# EAGLE design sensor only (EAGLE 7.6.0)
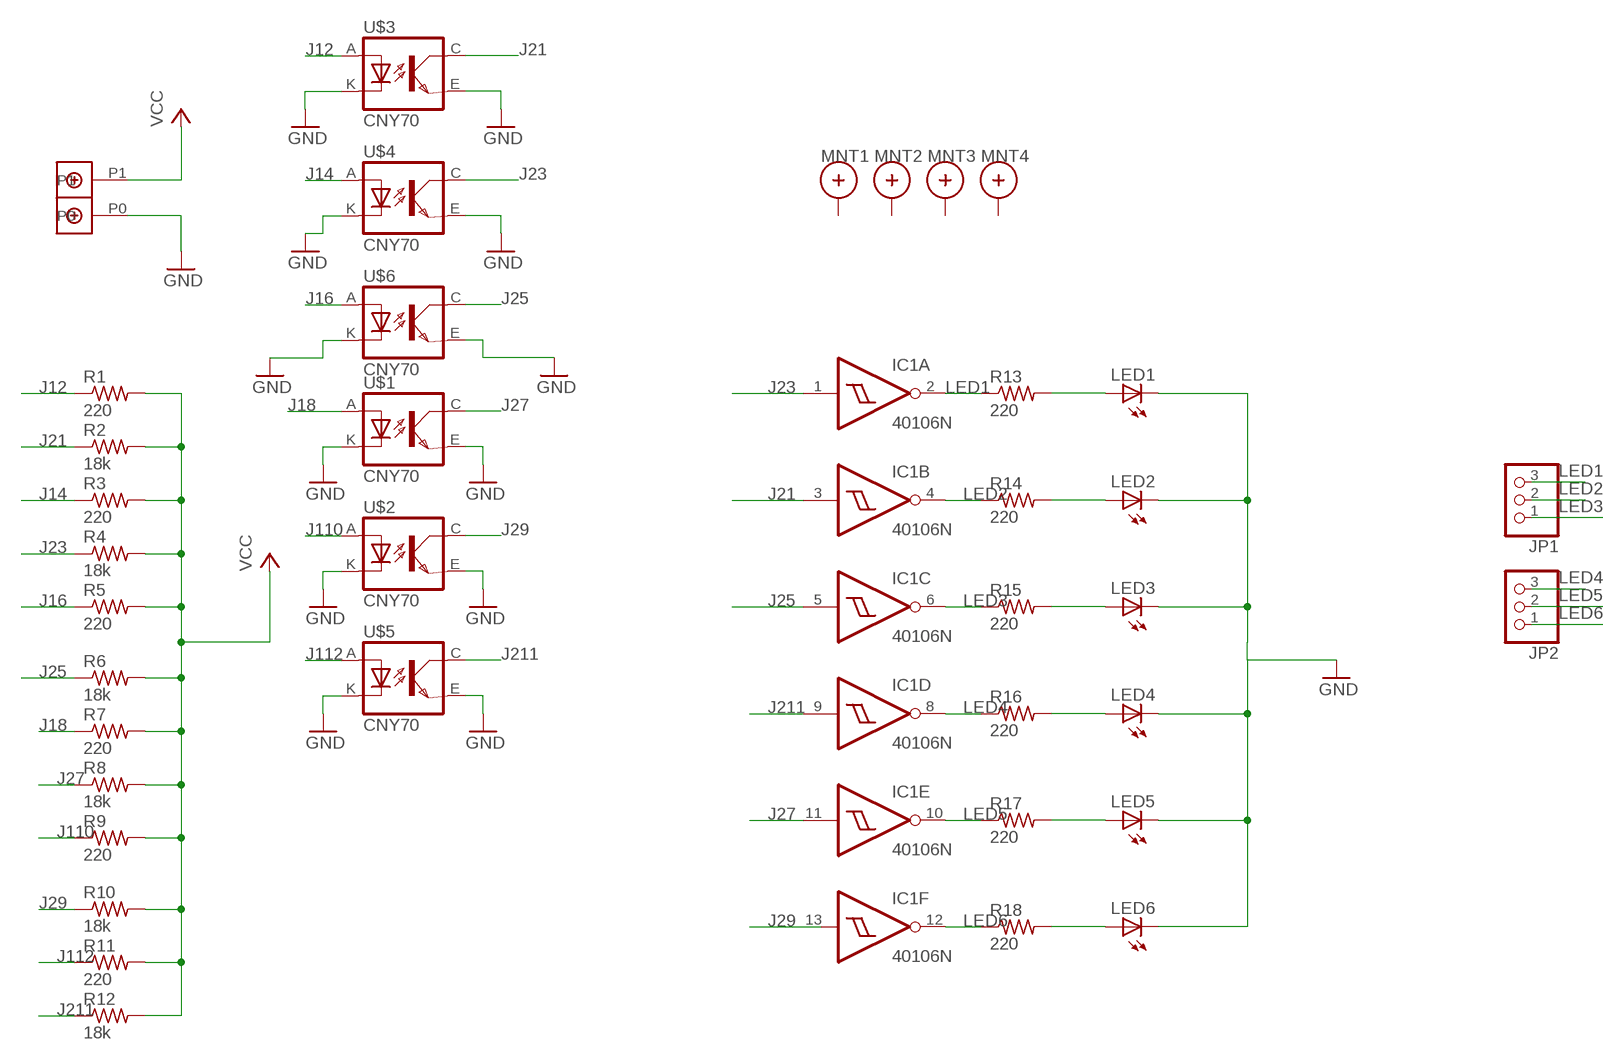
[diagram p0: schematic, sheet 1]

## Parts
IC1  40106N  [DIL14]
JP1  PINHD-1X3  [1X03]
JP2  PINHD-1X3  [1X03]
LED1  LEDCHIPLED_1206  [CHIPLED_1206]
LED2  LEDCHIPLED_1206  [CHIPLED_1206]
LED3  LEDCHIPLED_1206  [CHIPLED_1206]
LED4  LEDCHIPLED_1206  [CHIPLED_1206]
LED5  LEDCHIPLED_1206  [CHIPLED_1206]
LED6  LEDCHIPLED_1206  [CHIPLED_1206]
MNT1  HOLE_MNT_0.135  [HOLE_MNT_#5-40]
MNT2  HOLE_MNT_0.135  [HOLE_MNT_#5-40]
MNT3  HOLE_MNT_0.135  [HOLE_MNT_#5-40]
MNT4  HOLE_MNT_0.135  [HOLE_MNT_#5-40]
R1  220  R-US_M1206  [M1206]
R2  18k  R-US_M1206  [M1206]
R3  220  R-US_M1206  [M1206]
R4  18k  R-US_M1206  [M1206]
R5  220  R-US_M1206  [M1206]
R6  18k  R-US_M1206  [M1206]
R7  220  R-US_M1206  [M1206]
R8  18k  R-US_M1206  [M1206]
R9  220  R-US_M1206  [M1206]
R10  18k  R-US_M1206  [M1206]
R11  220  R-US_M1206  [M1206]
R12  18k  R-US_M1206  [M1206]
R13  220  R-US_M1206  [M1206]
R14  220  R-US_M1206  [M1206]
R15  220  R-US_M1206  [M1206]
R16  220  R-US_M1206  [M1206]
R17  220  R-US_M1206  [M1206]
R18  220  R-US_M1206  [M1206]
U$1  CNY70  [4]
U$2  CNY70  [4]
U$3  CNY70  [4]
U$4  CNY70  [4]
U$5  CNY70  [4]
U$6  CNY70  [4]
U$7  DBCONN-1X2  [DBCONN-1X2]

## Nets
GND: LED1.C LED2.C LED3.C LED4.C LED5.C LED6.C U$1.E(EMI) U$1.K(C) U$2.E(EMI) U$2.K(C) U$3.E(EMI) U$3.K(C) U$4.E(EMI) U$4.K(C) U$5.E(EMI) U$5.K(C) U$6.E(EMI) U$6.K(C) U$7.P0
J12: R1.1 U$3.A
J14: R3.1 U$4.A
J16: R5.1 U$6.A
J18: R7.1 U$1.A
J21: IC1.3(B:I) R2.1 U$3.C(COL)
J23: IC1.1(A:I) R4.1 U$4.C(COL)
J25: IC1.5(C:I) R6.1 U$6.C(COL)
J27: IC1.11(E:I) R8.1 U$1.C(COL)
J29: R10.1 U$2.C(COL)
J110: R9.1 U$2.A
J112: R11.1 U$5.A
J211: IC1.9(D:I) R12.1 U$5.C(COL)
LED1: IC1.2(A:O) JP1.3 R13.1
LED2: IC1.4(B:O) JP1.2 R14.1
LED3: IC1.6(C:O) JP1.1 R15.1
LED4: IC1.8(D:O) JP2.3 R16.1
LED5: IC1.10(E:O) JP2.2 R17.1
LED6: IC1.12(F:O) JP2.1 R18.1
N$10: LED1.A R13.2
N$11: LED2.A R14.2
N$12: LED3.A R15.2
N$13: LED4.A R16.2
N$14: LED5.A R17.2
N$15: LED6.A R18.2
VCC: R1.2 R2.2 R3.2 R4.2 R5.2 R6.2 R7.2 R8.2 R9.2 R10.2 R11.2 R12.2 U$7.P1
Unconnected: IC1.13(F:I) MNT1.P$1 MNT2.P$1 MNT3.P$1 MNT4.P$1

## Power pins joined to a net without a drawn wire
VDD: IC1.14(P:VDD)
VSS: IC1.7(P:VSS)

## Library data of the parts
IC1 = 40xx:40106: Hex SCHMITT TRIGGER
JP1 JP2 = pinhead:PINHD-1X3: PIN HEADER
LED1-LED6 = led:LED: LED OSRAM: - CHIPLED LG R971, LG N971, LY N971, LG Q971, LY Q971, LO R971, LY R971 LH N974, LH R974 LS Q976, LO Q976, LY Q976 LO Q996 - Hyper CHIPLED LW Q18S LB Q993, LB Q99A, LB R99A - SideLED LS A670, LO A670, LY A670, LG A670, LP A670 LB A673, LV A673, LT A673, LW A673 LH A674 LY A675 LS A676, LA A676, LO A676, LY A676, LW A676 LS A679, LY A679, LG A679 - Hyper Micro SIDELED® LS Y876, LA Y876, LO Y876, LY Y876 LT Y87S - SmartLED LW L88C, LW L88S LB L89C, LB L89S, LG L890 LS L89K, LO L89K, LY L89K LS L896, LA L896, LO L896, LY L896 - TOPLED LS T670, LO T670, LY T670, LG T670, LP T670 LSG T670, LSP T670, LSY T670, LOP T670, LYG T670 LG T671, LOG T671, LSG T671 LB T673, LV T673, LT T673, LW T673 LH T674 LS T676, LA T676, LO T676, LY T676, LB T676, LH T676, LSB T676, LW T676 LB T67C, LV T67C, LT T67C, LS T67K, LO T67K, LY T67K, LW E67C LS E67B, LA E67B, LO E67B, LY E67B, LB E67C, LV E67C, LT E67C LW T67C LS T679, LY T679, LG T679 LS T770, LO T770, LY T770, LG T770, LP T770 LB T773, LV T773, LT T773, LW T773 LH T774 LS E675, LA E675, LY E675, LS T675 LS T776, LA T776, LO T776, LY T776, LB T776 LHGB T686 LT T68C, LB T68C - Hyper Mini TOPLED® LB M676 - Mini TOPLED Santana® LG M470 LS M47K, LO M47K, LY M47K Source: http://www.osram.convergy.de LUXEON: - LUMILED® LXK2-PW12-R00, LXK2-PW12-S00, LXK2-PW14-U00, LXK2-PW14-V00 LXK2-PM12-R00, LXK2-PM12-S00, LXK2-PM14-U00 LXK2-PE12-Q00, LXK2-PE12-R00, LXK2-PE12-S00, LXK2-PE14-T00, LXK2-PE14-U00 LXK2-PB12-K00, LXK2-PB12-L00, LXK2-PB12-M00, LXK2-PB14-N00, LXK2-PB14-P00, LXK2-PB14-Q00 LXK2-PR12-L00, LXK2-PR12-M00, LXK2-PR14-Q00, LXK2-PR14-R00 LXK2-PD12-Q00, LXK2-PD12-R00, LXK2-PD12-S00 LXK2-PH12-R00, LXK2-PH12-S00 LXK2-PL12-P00, LXK2-PL12-Q00, LXK2-PL12-R00 Source: www.luxeon.com KINGBRIGHT: KA-3528ASYC Source: www.kingbright.com
MNT1-MNT4 = Existing Library:HOLE_MNT_0.135: Mounting Hole. 0.135 plated hole created for a #5-40 screw, McMaster p/n 91772A125
R1-R18 = resistor:R-US_: RESISTOR, American symbol
U$1-U$6 = cny70:CNY70
U$7 = Terminal Block Connector:DBCONN-1X2

## Board
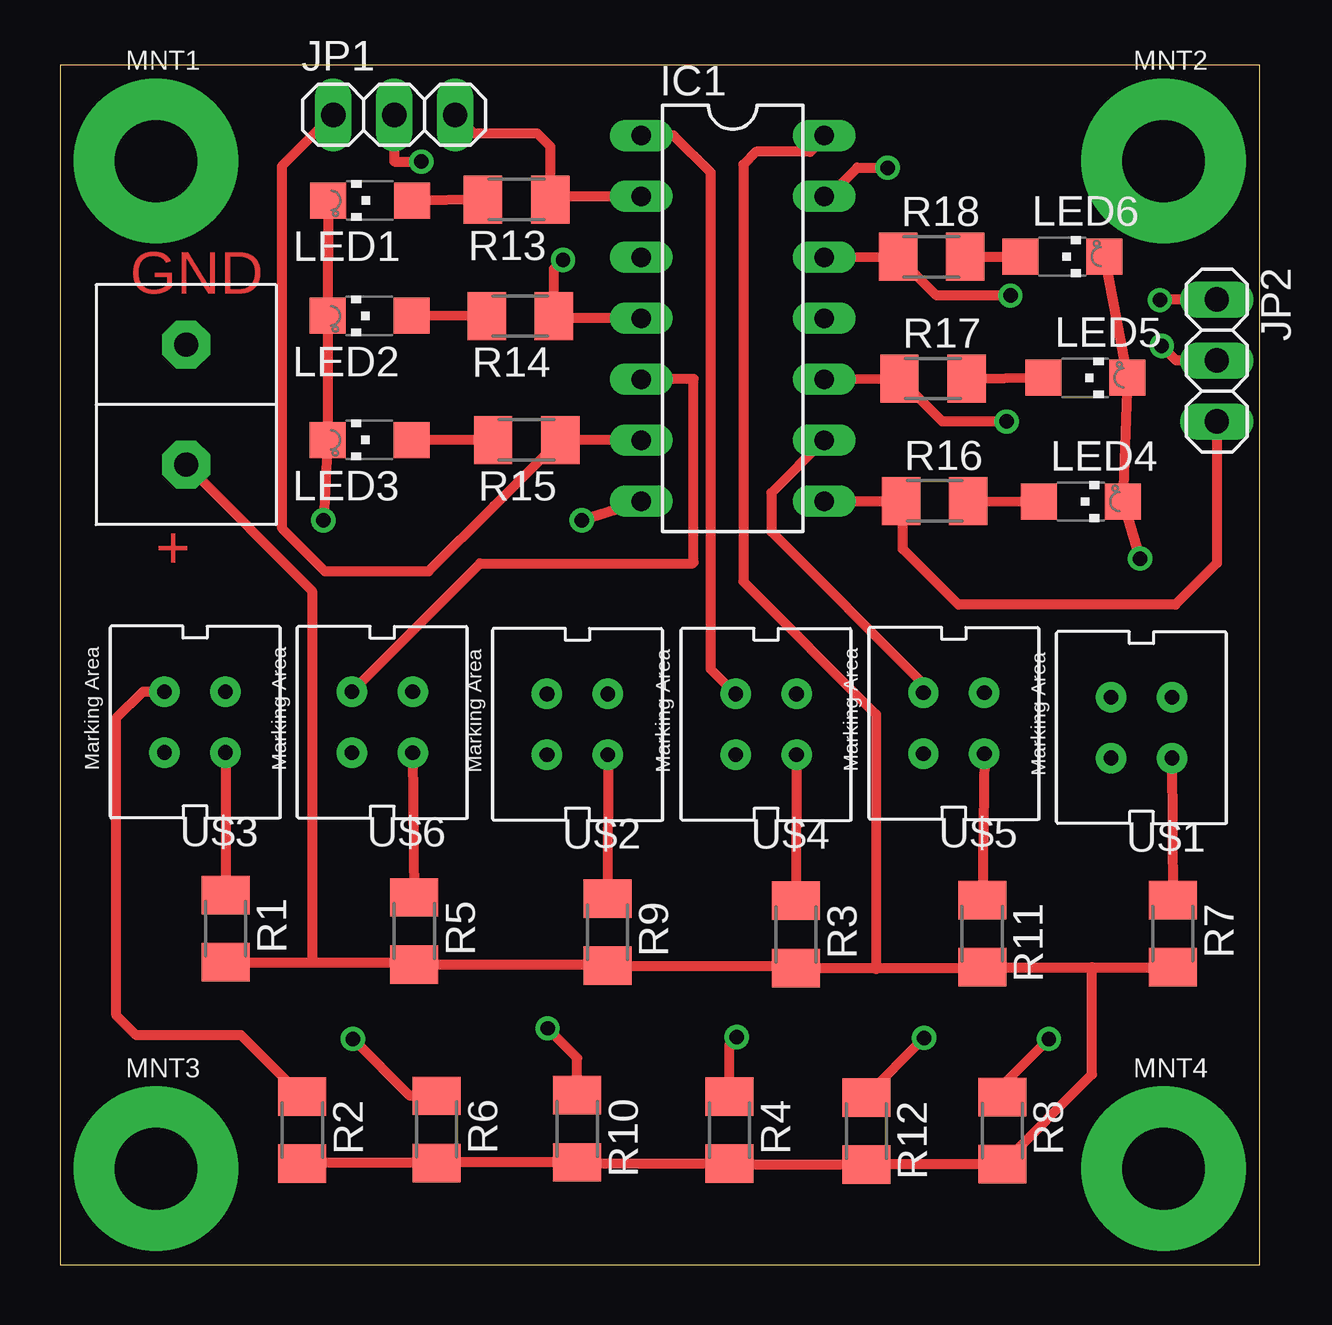
[diagram p1: board, top side]
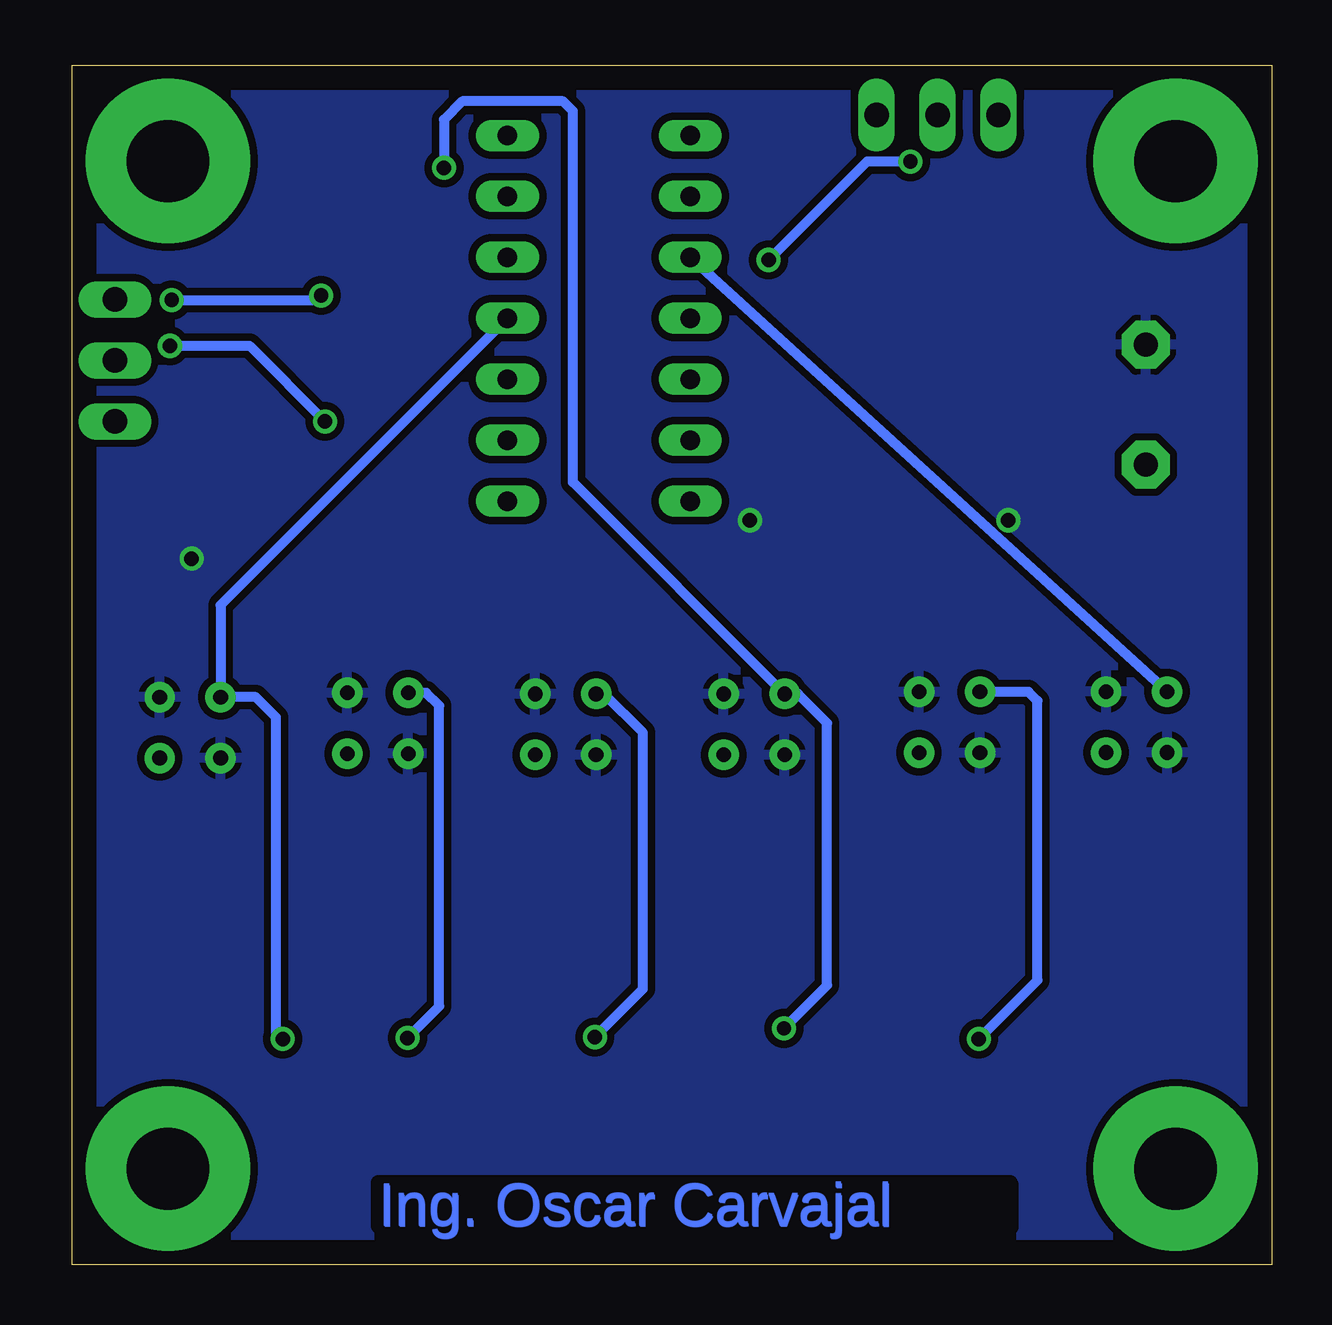
[diagram p2: board, bottom side, seen from below]

Size 50 x 50 mm. Coordinates in mm from the lower left corner, seen from the top.
Outline: 0,0 50,0 50,50 0,50 0,0
Copper layers (1*16): Top 0.035mm / dielectric 1.5mm / Bottom 0.035mm
Design rules "default": minimum track width 10mil, minimum drill 24mil, track to track 8mil, track to pad 8mil, pad to pad 8mil, via to via 8mil, smd to smd 8mil, copper to edge 40mil, drill to drill 8mil, minimum pad ring 10mil, minimum via ring 8mil, stop-mask expansion 4mil, vias tented up to drill 0mil, thermal gap 10mil

### Footprints (pad centres in the part's own frame; a part is rotated, then mirrored left to right if it is on the bottom)
DIL14 = drill 0.813 long: 1 -7.62,-3.81; 2 -5.08,-3.81; 3 -2.54,-3.81; 4 0,-3.81; 5 2.54,-3.81; 6 5.08,-3.81; 7 7.62,-3.81; 8 7.62,3.81; 9 5.08,3.81; 10 2.54,3.81; 11 0,3.81; 12 -2.54,3.81; 13 -5.08,3.81; 14 -7.62,3.81
1X03 = drill 1.016 long: 1 -2.54,0; 2 0,0; 3 2.54,0
CHIPLED_1206 = smd 1.5 x 1.5: A 0,-1.75; C 0,1.75
HOLE_MNT_#5-40 = drill 3.429 pad 6.858: P$1 0,0
M1206 = smd 1.6 x 2: 1 -1.4,0; 2 1.4,0
4 = drill 0.61 pad 1.27: A -1.27,1.27; C 1.27,-1.27; E 1.27,1.27; K -1.27,-1.27
DBCONN-1X2 = drill 1 pad 2 octagon: P0 -2.54,0; P1 2.46,0

### Placement (x,y rotation side)
IC1  28.04,39.45 270 top
JP1  13.93,47.93 0 top
JP2  48.22,37.69 270 top
LED1  12.92,44.36 90 top
LED2  12.9,39.55 90 top
LED3  12.9,34.38 90 top
LED4  42.55,31.81 270 top
LED5  42.73,36.97 270 top
LED6  41.78,42.02 270 top
MNT1  4,46 0 top
MNT2  46,46 0 top
MNT3  4,4 0 top
MNT4  46,4 0 top
R1  6.91,14.01 270 top
R2  10.1,5.61 270 top
R3  30.68,13.77 270 top
R4  27.91,5.61 270 top
R5  14.77,13.91 270 top
R6  15.7,5.64 270 top
R7  46.39,13.8 270 top
R8  39.28,5.59 270 top
R9  22.82,13.86 270 top
R10  21.56,5.67 270 top
R11  38.44,13.8 270 top
R12  33.61,5.57 270 top
R13  19.03,44.4 180 top
R14  19.19,39.54 180 top
R15  19.45,34.38 180 top
R16  36.46,31.84 0 top
R17  36.39,36.94 0 top
R18  36.33,42.01 0 top
U$1  45.08,22.39 180 top
U$2  21.57,22.52 180 top
U$3  5.63,22.62 180 top
U$4  29.43,22.52 180 top
U$5  37.26,22.57 180 top
U$6  13.43,22.61 180 top
U$7  5.25,35.81 270 top

### Tracks (layer width: path | path; a pad name or v marks a point on that pad's centre or on a via)
GND  (via drill 0.6)
  Top 0.406: LED6.C LED5.C LED4.C v45.02,29.43 | LED1.C LED2.C LED3.C v10.98,31.03
  other vias: 21.75,31.03
  pour Bottom (isolate 0.305): 7.82,49.37 49.59,49.37 49.59,0.35 0.35,0.35 0.35,10.8 0.35,49.65 7.82,49.65
J12
  Top 0.406: U$3.A R1.1
J14
  Top 0.406: U$4.A R3.1
J16
  Top 0.406: U$6.A R5.1
J18
  Top 0.406: U$1.A R7.1
J21
  Top 0.406: R2.1 7.55,9.56 3.18,9.56 2.35,10.39 2.35,22.78 3.46,23.89 U$3.C
  Bottom 0.406: U$3.C IC1.3
J23  (via drill 0.6)
  Top 0.406: U$4.C 27.13,24.82 27.13,45.52 25.58,47.07 IC1.1 | R4.1 27.91,9.19 v28.21,9.49
  Bottom 0.406: v28.21,9.49 26.21,11.49 26.21,22.18 27.82,23.79 U$4.C
J25  (via drill 0.6)
  Top 0.406: U$6.C 17.51,29.23 26.37,29.23 26.41,29.27 26.41,36.92 26.4,36.91 IC1.5 | R6.1 14.58,7.04 v12.21,9.41
  Bottom 0.406: v12.21,9.41 9.76,11.86 9.76,23.5 10.14,23.88 U$6.C
J27  (via drill 0.6)
  Top 0.406: R8.1 39.28,7.47 v41.22,9.41
  Bottom 0.406: v41.22,9.41 41.5,9.69 41.5,22.82 42.34,23.66 U$1.C 43.81,27.49 IC1.11
J29  (via drill 0.6)
  Top 0.406: R10.1 21.56,8.62 v20.33,9.85
  Bottom 0.406: v20.33,9.85 18.53,11.65 18.53,22.58 19.74,23.79 U$2.C 29.13,32.62 29.13,48.09 29.53,48.49 33.74,48.49 34.5,47.73 v34.5,45.72
J110
  Top 0.406: U$2.A R9.1
J112
  Top 0.406: U$5.A R11.1
J211  (via drill 0.6)
  Top 0.406: IC1.9 29.65,32.17 29.65,30.55 35.99,24.21 U$5.C | R12.1 33.61,7.04 v36.02,9.45
  Bottom 0.406: v36.02,9.45 34.7,10.77 34.7,23.3 35.24,23.84 U$5.C
LED1
  Top 0.406: JP1.3 17.24,47.16 19.89,47.16 20.43,46.62 R13.1 20.56,44.53 IC1.2
LED2  (via drill 0.6)
  Top 0.406: IC1.4 20.68,39.45 R14.1 20.59,41.5 v20.97,41.88 | JP1.2 13.93,45.98 v15.06,45.98
  Bottom 0.406: v15.06,45.98 16.87,45.98 v20.97,41.88
LED3
  Top 0.406: IC1.6 R15.1 18.1,31.63 18.09,31.63 15.37,28.91 11.04,28.91 9.24,30.71 9.24,45.78 JP1.1
LED4
  Top 0.406: IC1.8 R16.1 35.13,31.77 35.13,29.83 37.45,27.51 46.49,27.51 48.22,29.24 JP2.3
LED5  (via drill 0.6)
  Top 0.406: IC1.10 R17.1 36.78,35.15 v39.46,35.15 | JP2.2 46.53,37.69 v45.92,38.3
  Bottom 0.406: v45.92,38.3 42.61,38.3 v39.46,35.15
LED6  (via drill 0.6)
  Top 0.406: IC1.12 R18.1 36.54,40.4 v39.62,40.4 | JP2.1 45.87,40.23 v45.85,40.21
  Bottom 0.406: 39.79,40.23 v39.62,40.4 39.81,40.21 v45.85,40.21
N$1
  Top 0.406: 21.74,31.03 24.26,31.84
N$2
  Top 0.406: 31.95,47.06 31.28,46.39 29.01,46.39 28.48,45.86 28.48,28.48 34.02,22.94 34.02,12.33
N$3
  Top 0.406: 31.94,44.44 33.23,45.73 34.55,45.73
N$10
  Top 0.406: R13.2 LED1.A
N$11
  Top 0.406: R14.2 LED2.A
N$12
  Top 0.406: R15.2 LED3.A
N$13
  Top 0.406: R16.2 LED4.A
N$14
  Top 0.406: R17.2 LED5.A
N$15
  Top 0.406: R18.2 LED6.A
VCC
  Top 0.406: R1.2 10.51,12.61 | 10.51,12.61 14.77,12.61 R5.2 22.82,12.51 R9.2 30.68,12.46 R3.2 38.44,12.37 R11.2 43.02,12.4 | 43.02,12.4 R7.2 | R2.2 10.1,4.24 R6.2 15.7,4.15 14.94,4.15 14.94,4.27 R10.2 21.56,4.21 R4.2 27.91,4.17 R12.2 33.61,4.19 R8.2 43.02,7.93 43.02,12.4 | U$7.P1 10.51,28.09 10.51,12.61

### Text on the board
Top: GND | +
Bottom: Ing. Oscar Carvajal | Ing. Oscar Carvajal | Ing. Oscar Carvajal